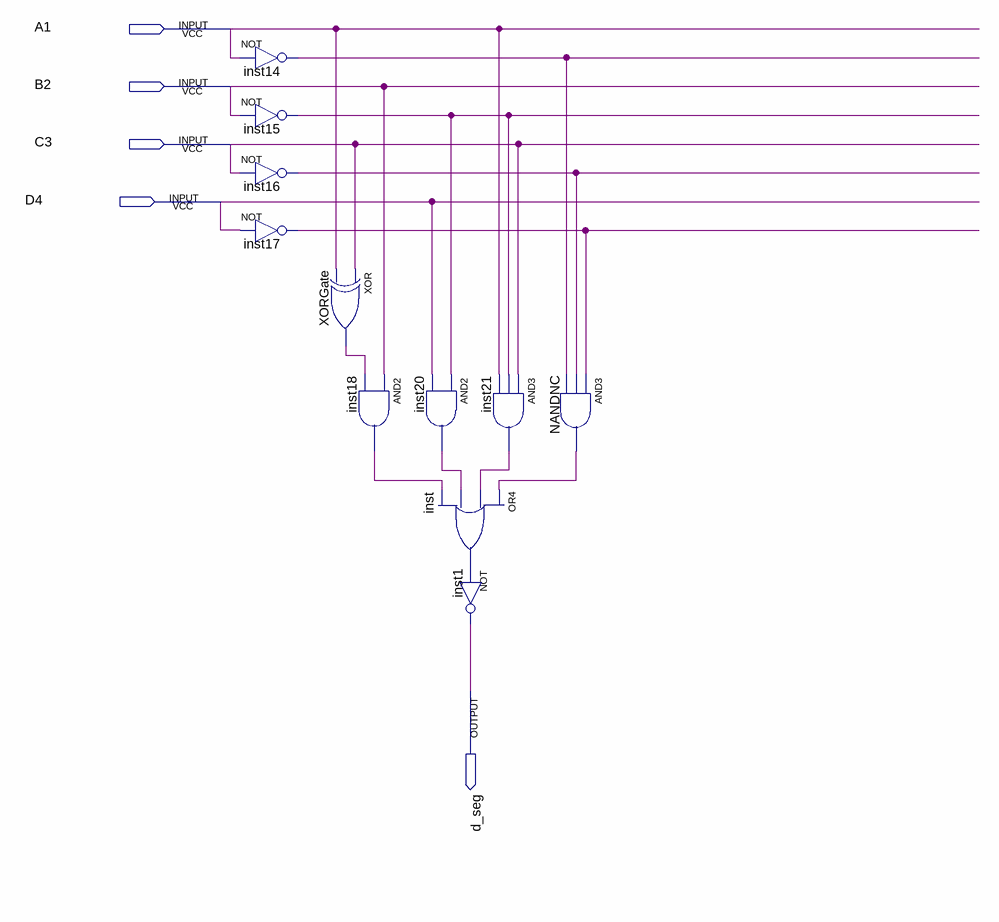
[diagram p0: schematic sheet]
// Quartus schematic dlight.bdf as structural Verilog: 11 symbols, 5 pins
module dlight (
  input  A1,
  input  B2,
  input  C3,
  input  D4,
  output d_seg
);

  wire inst14_out, inst15_out, inst16_out, inst17_out, inst18_out, inst20_out, inst21_out, inst_out,
       NANDNC_out, XORGate_out;

  not inst14 (inst14_out, A1);
  not inst15 (inst15_out, B2);
  not inst16 (inst16_out, C3);
  not inst17 (inst17_out, D4);
  xor XORGate (XORGate_out, C3, A1);
  and inst18 (inst18_out, B2, XORGate_out);
  and inst20 (inst20_out, inst15_out, D4);
  or inst (inst_out, NANDNC_out, inst21_out, inst20_out, inst18_out);
  and inst21 (inst21_out, C3, inst15_out, A1);
  not inst1 (d_seg, inst_out);
  and NANDNC (NANDNC_out, inst17_out, inst16_out, inst14_out);
endmodule
